# Altium project Servo_arm_controller.PrjPcb
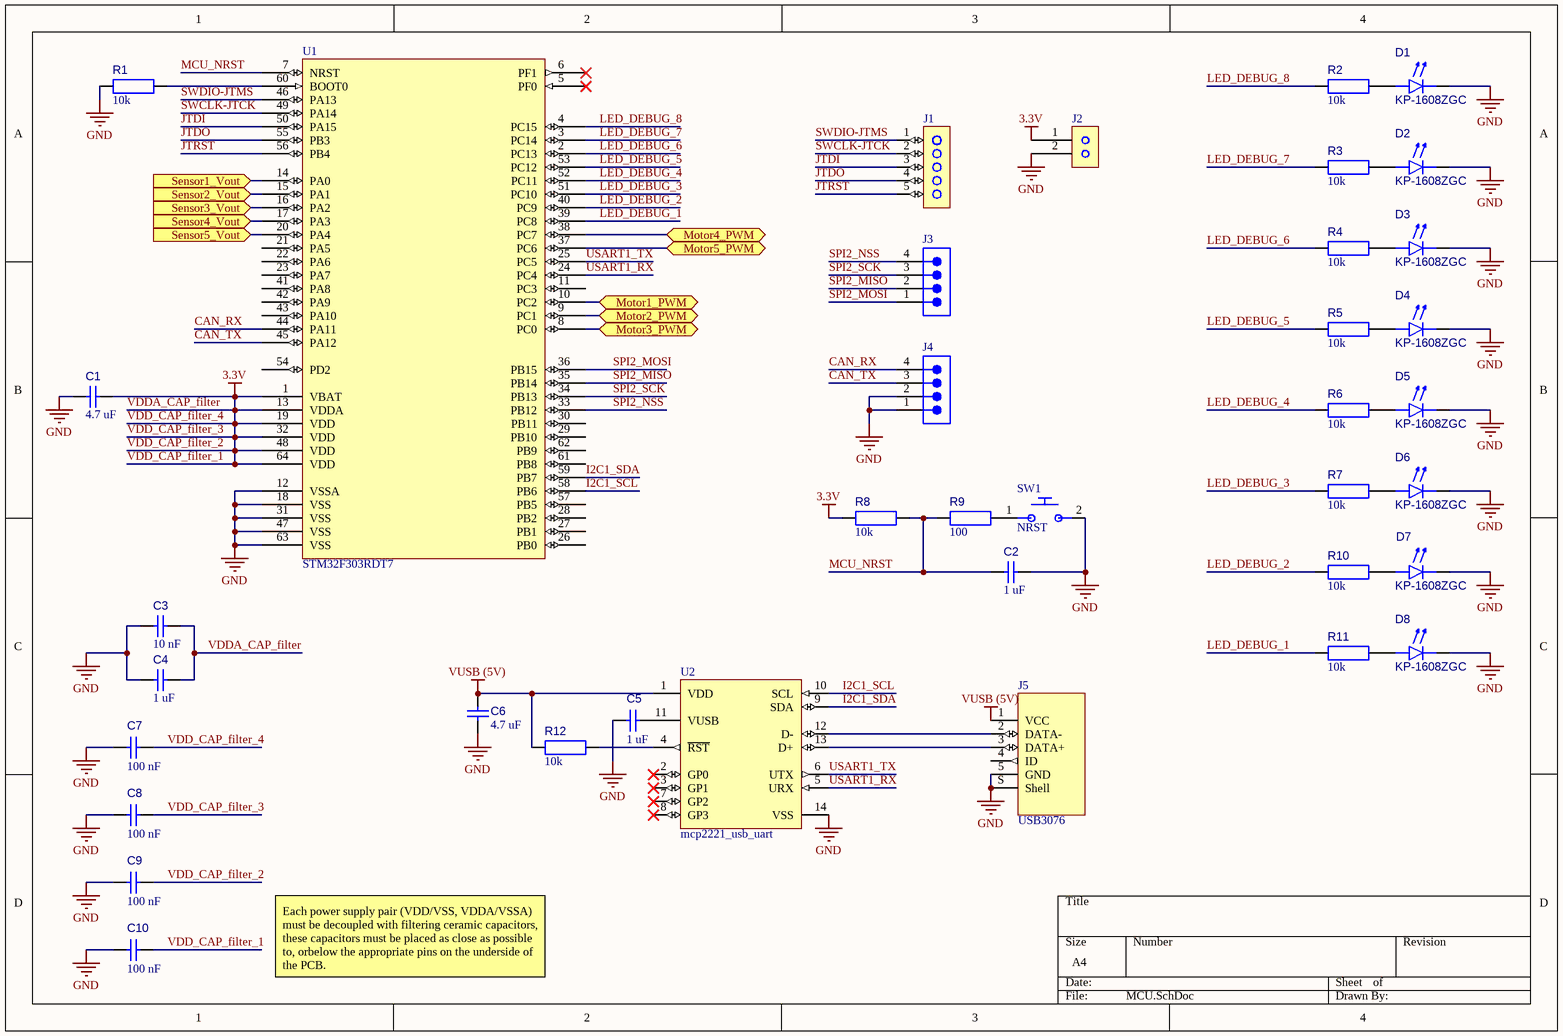
[diagram p0: MCU.SchDoc]
2 sheets, 70 parts. Net scope: flat (ports and power ports of the same name join across sheets).
Board file: Arm_controller.PcbDoc
Sheets:
  MCU.SchDoc
  Signal_and_supply.SchDoc

## Sheet MCU.SchDoc
size A4; SheetNumber: 1; SheetTotal: 2

### Parts
C1  Capacitance: 4.7 uF  [CAPC1608X08N]  (hidden comment: Capacitor 0603 generic)
C2  Capacitance: 1 uF  [CAPC1608X08N]  (hidden comment: Capacitor 0603 generic)
C3  Capacitance: 10 nF  [CAPC1608X08N]  (hidden comment: Capacitor 0603 generic)
C4  Capacitance: 1 uF  [CAPC1608X08N]  (hidden comment: Capacitor 0603 generic)
C5  Capacitance: 1 uF  [CAPC1608X08N]  (hidden comment: Capacitor 0603 generic)
C6  Capacitance: 4.7 uF  [CAPC1608X08N]  (hidden comment: Capacitor 0603 generic)
C7  Capacitance: 100 nF  [CAPC1608X08N]  (hidden comment: Capacitor 0603 generic)
C8  Capacitance: 100 nF  [CAPC1608X08N]  (hidden comment: Capacitor 0603 generic)
C9  Capacitance: 100 nF  [CAPC1608X08N]  (hidden comment: Capacitor 0603 generic)
C10  Capacitance: 100 nF  [CAPC1608X08N]  (hidden comment: Capacitor 0603 generic)
D1  KP-1608ZGC  [DIOM1608X11N]
D2  KP-1608ZGC  [DIOM1608X11N]
D3  KP-1608ZGC  [DIOM1608X11N]
D4  KP-1608ZGC  [DIOM1608X11N]
D5  KP-1608ZGC  [DIOM1608X11N]
D6  KP-1608ZGC  [DIOM1608X11N]
D7  KP-1608ZGC  [DIOM1608X11N]
D8  KP-1608ZGC  [DIOM1608X11N]
J1  Header-2.54-ZL201-05G  [Header-2.54-ZL201-05G-Footprint-1]  (value not drawn)
J2  2_pin_f_2_54  [2_pin_f_2_54-Footprint-1]  (value not drawn)
J3  MTLW-104-07-F-S-125  [SMTC-MTLW-104-07-X-S-125]  (value not drawn)
J4  MTLW-104-07-F-S-125  [SMTC-MTLW-104-07-X-S-125]  (value not drawn)
J5  USB3076  [USB3076-XX-X_revC]
R1  Resistance: 10k  [RESC1608X04N]  (hidden comment: Resistor 0603 generic)
R2  Resistance: 10k  [RESC1608X04N]  (hidden comment: Resistor 0603 generic)
R3  Resistance: 10k  [RESC1608X04N]  (hidden comment: Resistor 0603 generic)
R4  Resistance: 10k  [RESC1608X04N]  (hidden comment: Resistor 0603 generic)
R5  Resistance: 10k  [RESC1608X04N]  (hidden comment: Resistor 0603 generic)
R6  Resistance: 10k  [RESC1608X04N]  (hidden comment: Resistor 0603 generic)
R7  Resistance: 10k  [RESC1608X04N]  (hidden comment: Resistor 0603 generic)
R8  Resistance: 10k  [RESC1608X04N]  (hidden comment: Resistor 0603 generic)
R9  Resistance: 100  [RESC1608X04N]  (hidden comment: Resistor 0603 generic)
R10  Resistance: 10k  [RESC1608X04N]  (hidden comment: Resistor 0603 generic)
R11  Resistance: 10k  [RESC1608X04N]  (hidden comment: Resistor 0603 generic)
R12  Resistance: 10k  [RESC1608X04N]  (hidden comment: Resistor 0603 generic)
SW1  NRST  [Button 6mm tht-Footprint-1]
U1  STM32F303RDT7  [LQFP50P1235X1235X165-64N]
U2  mcp2221_usb_uart  [FP-C04-065-SL-IPC_B]

### Ports
Motor1_PWM (bidir, see Signal_and_supply[2A]), Motor2_PWM (bidir, see Signal_and_supply[2A]), Motor3_PWM (bidir, see Signal_and_supply[2A]), Motor4_PWM (bidir, see Signal_and_supply[2A]), Motor5_PWM (bidir, see Signal_and_supply[2A]), Sensor1_Vout (in, see Signal_and_supply[4A]), Sensor2_Vout (in, see Signal_and_supply[4B]), Sensor3_Vout (in, see Signal_and_supply[4B]), Sensor4_Vout (in, see Signal_and_supply[4C]), Sensor5_Vout (in, see Signal_and_supply[4C])

### Nets
GND: C1.2 C2.1 C3.2 C4.2 C5.2 C6.2 C7.2 C8.2 C9.2 C10.2 D1.1(-) D2.1(-) D3.1(-) D4.1(-) D5.1(-) D6.1(-) D7.1(-) D8.1(-) J2.2(GND) J4.1 J4.2 J5.5(GND) J5.S(Shell) R1.1 SW1.2 U1.12(VSSA) U1.18(VSS) U1.31(VSS) U1.47(VSS) U1.63(VSS) U2.14(VSS)
VDD_CAP_filter_1: C1.1 C3.1 C4.1 C7.1 C8.1 C9.1 C10.1 J2.1(VDD) R8.1 U1.1(VBAT) U1.13(VDDA) U1.19(VDD) U1.32(VDD) U1.48(VDD) U1.64(VDD)  [also labelled 3.3V, VDD_CAP_filter_2, VDD_CAP_filter_3, VDD_CAP_filter_4, VDDA_CAP_filter]
VUSB (5V): C6.1 J5.1(VCC) R12.2 U2.1(VDD)
CAN_RX: J4.4 U1.44(PA11)
CAN_TX: J4.3 U1.45(PA12)
I2C1_SCL: U1.58(PB6) U2.10(SCL)
I2C1_SDA: U1.59(PB7) U2.9(SDA)
JTDI: J1.3 U1.50(PA15)
JTDO: J1.4 U1.55(PB3)
JTRST: J1.5 U1.56(PB4)
LED_DEBUG_1: R11.1 U1.39(PC8)
LED_DEBUG_2: R10.1 U1.40(PC9)
LED_DEBUG_3: R7.1 U1.51(PC10)
LED_DEBUG_4: R6.1 U1.52(PC11)
LED_DEBUG_5: R5.1 U1.53(PC12)
LED_DEBUG_6: R4.1 U1.2(PC13)
LED_DEBUG_7: R3.1 U1.3(PC14)
LED_DEBUG_8: R2.1 U1.4(PC15)
MCU_NRST: C2.2 R8.2 R9.1 U1.7(NRST)
Motor1_PWM: U1.10(PC2) ; port Motor1_PWM
Motor2_PWM: U1.9(PC1) ; port Motor2_PWM
Motor3_PWM: U1.8(PC0) ; port Motor3_PWM
Motor4_PWM: U1.38(PC7) ; port Motor4_PWM
Motor5_PWM: U1.37(PC6) ; port Motor5_PWM
SPI2_MISO: J3.2 U1.35(PB14)
SPI2_MOSI: J3.1 U1.36(PB15)
SPI2_NSS: J3.4 U1.33(PB12)
SPI2_SCK: J3.3 U1.34(PB13)
SWCLK-JTCK: J1.2 U1.49(PA14)
SWDIO-JTMS: J1.1 U1.46(PA13)
USART1_RX: U1.24(PC4) U2.5(URX)
USART1_TX: U1.25(PC5) U2.6(UTX)
NetC5_1: C5.1 U2.11(VUSB)
NetD1_2: D1.2(+) R2.2
NetD2_2: D2.2(+) R3.2
NetD3_2: D3.2(+) R4.2
NetD4_2: D4.2(+) R5.2
NetD5_2: D5.2(+) R6.2
NetD6_2: D6.2(+) R7.2
NetD7_2: D7.2(+) R10.2
NetD8_2: D8.2(+) R11.2
NetJ5_2: J5.2(DATA-) U2.12(D-)
NetJ5_3: J5.3(DATA+) U2.13(D+)
NetR1_2: R1.2 U1.60(BOOT0)
NetR9_2: R9.2 SW1.1
NetR12_1: R12.1 U2.4(~{RST})
NetU1_14: U1.14(PA0) ; port Sensor1_Vout
NetU1_15: U1.15(PA1) ; port Sensor2_Vout
NetU1_16: U1.16(PA2) ; port Sensor3_Vout
NetU1_17: U1.17(PA3) ; port Sensor4_Vout
NetU1_20: U1.20(PA4) ; port Sensor5_Vout

Not connected (* = marked no-connect by the designer): J5 4(ID); U1 5(PF0)* 6(PF1)* 11(PC3) 21(PA5) 22(PA6) 23(PA7) 26(PB0) 27(PB1) 28(PB2) 29(PB10) 30(PB11) 41(PA8) 42(PA9) 43(PA10) 54(PD2) 57(PB5) 61(PB8) 62(PB9); U2 2(GP0)* 3(GP1)* 7(GP2)* 8(GP3)*

### Notes on the sheet
- Each power supply pair (VDD/VSS, VDDA/VSSA) must be decoupled with filtering ceramic capacitors, these capacitors must be placed as close as possible to, orbelow the appropriate pins on the underside of the PCB.

### Library data of the parts
C1-C10 = CMP-001-00083-2: Generic 0603 capacitor. No set voltage/capacitance rating.
D1-D8 = CMP-007-00036-1: Single Color LED, Green, Water Clear, 1.2mm; Forward Current: 25mA; Max Operating Temperature: 85°C; RoHS Compliant: Yes; Min Operating Temperature: -40°C; Pins: 2; Mounting Technology: Surface Mount
J1 = CMP-00028-00007-3: Male header, pitch 2.54 mm, 1x5 pins
J2 = CMP-00028-00011-1: 2 pin female header, 2.54 mm pitch.
J3 J4 = CMP-1024-00073-1: Low Profile .025" SQ Post Header, Through-hole, Vertical, -55 to 125 degC, 2.54 mm Pitch, 4-Pin, Male, RoHS; Manufacturer: Samtec; Pitch: 2.54 mm; ComponentLink1URL: http://www.samtec.com; PartNumber: MTLW-104-07-F-S-125; Mounting Technology: Through-hole; ComponentLink2Description: Datasheet; Orientation: Vertical; PackageReference: MTLW-104-07-X-S-125; ComponentLink2URL: http://www.samtec.com/documents/webfiles/pdf/MTLW_TH.PDF; ComponentLink3URL: http://www.samtec.com/documents/webfiles/cpdf/MTLW-1XX-XX-XX-X-XXX-XX-XX-MKT1.pdf; ComponentLink1Description: Manufacturer URL; PackageVersion: T, 6/1991; Temperature Range: -55 to 125 degC; RoHS: True; DatasheetVersion: F-214; PackageDescription: Low Profile Terminal Assembly; ComponentLink3Description: Package Specification
J5 = CMP-003-000000-4: Micro USB Receptacle, Type B, SMT, Horizontal, Bottom Mount, without Peg, with Outer Shell Stakes, without Mating Face Lead-In; Pin Count: 6; Source: USB3076-XX-X_revC.SchLib; Design Item ID: USB3076-XX-X_revC; Component Type: Standard
R1-R12 = CMP-009-00177-2: Generic 0603 resistor, no fixed value.
SW1 = CMP-00028-00009-2: Button 6mm tht; Pins: 2
U1 = CMP-020-00023-3: ARM Microcontroller, 32-Bit, FLASH, CORTEX-M4F CPU, 72MHz, CMOS, LQFP64; Interface: I2C,SPI,USB,CAN,I2S,IrDA,UART,USART,LIN; Case/Package: LQFP; Pins: 64; Min Operating Temperature: -40°C; Max Operating Temperature: 105°C; RoHS Compliant: Yes
U2 = CMP-015-00009-2: Usb uart converter.; Max Supply Voltage: 5.5V; Min Supply Voltage: 3V; Nominal Supply Voltage: 3.3V; Min Operating Temperature: -40°C; Pins: 14; Max Operating Temperature: 85°C; RoHS Compliant: Yes; Case/Package: SOP

## Sheet Signal_and_supply.SchDoc
size A4; SheetNumber: 2; SheetTotal: 2
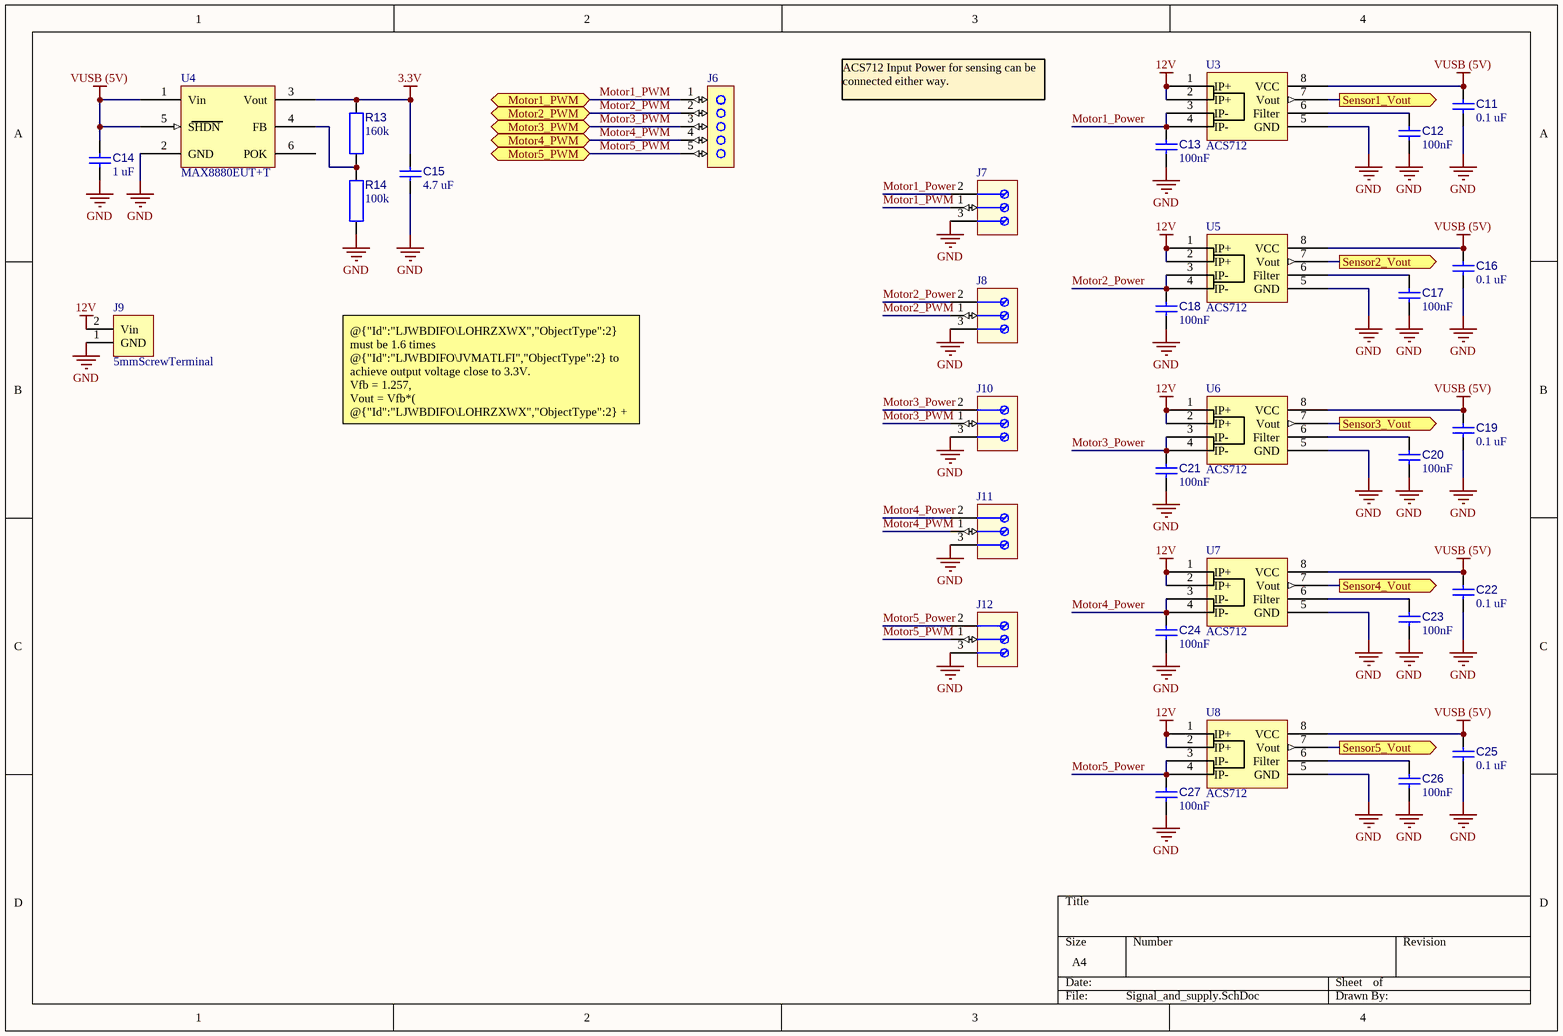
[diagram p1: Signal_and_supply.SchDoc]

### Parts
C11  Capacitance: 0.1 uF  [CAPC1608X08N]  (hidden comment: Capacitor 0603 generic)
C12  value 100nF  [CAPC1608X90X40NL10T20]  (hidden comment: Capacitor 100 nF +/-10% 50 V 0603)
C13  value 100nF  [CAPC1608X90X40NL10T20]  (hidden comment: Capacitor 100 nF +/-10% 50 V 0603)
C14  Capacitance: 1 uF  [CAPC1608X08N]  (hidden comment: Capacitor 0603 generic)
C15  Capacitance: 4.7 uF  [CAPC1608X08N]  (hidden comment: Capacitor 0603 generic)
C16  Capacitance: 0.1 uF  [CAPC1608X08N]  (hidden comment: Capacitor 0603 generic)
C17  value 100nF  [CAPC1608X90X40NL10T20]  (hidden comment: Capacitor 100 nF +/-10% 50 V 0603)
C18  value 100nF  [CAPC1608X90X40NL10T20]  (hidden comment: Capacitor 100 nF +/-10% 50 V 0603)
C19  Capacitance: 0.1 uF  [CAPC1608X08N]  (hidden comment: Capacitor 0603 generic)
C20  value 100nF  [CAPC1608X90X40NL10T20]  (hidden comment: Capacitor 100 nF +/-10% 50 V 0603)
C21  value 100nF  [CAPC1608X90X40NL10T20]  (hidden comment: Capacitor 100 nF +/-10% 50 V 0603)
C22  Capacitance: 0.1 uF  [CAPC1608X08N]  (hidden comment: Capacitor 0603 generic)
C23  value 100nF  [CAPC1608X90X40NL10T20]  (hidden comment: Capacitor 100 nF +/-10% 50 V 0603)
C24  value 100nF  [CAPC1608X90X40NL10T20]  (hidden comment: Capacitor 100 nF +/-10% 50 V 0603)
C25  Capacitance: 0.1 uF  [CAPC1608X08N]  (hidden comment: Capacitor 0603 generic)
C26  value 100nF  [CAPC1608X90X40NL10T20]  (hidden comment: Capacitor 100 nF +/-10% 50 V 0603)
C27  value 100nF  [CAPC1608X90X40NL10T20]  (hidden comment: Capacitor 100 nF +/-10% 50 V 0603)
J6  Header-2.54-ZL201-05G  [Header-2.54-ZL201-05G-Footprint-1]  (value not drawn)
J7  691103110003  [691103110003]  (value not drawn)
J8  691103110003  [691103110003]  (value not drawn)
J9  5mmScrewTerminal  [5mmScrewTerminal-Footprint-1]
J10  691103110003  [691103110003]  (value not drawn)
J11  691103110003  [691103110003]  (value not drawn)
J12  691103110003  [691103110003]  (value not drawn)
R13  Resistance: 160k  [RESC1608X04N]  (hidden comment: Resistor 0603 generic)
R14  Resistance: 100k  [RESC1608X04N]  (hidden comment: Resistor 0603 generic)
U3  ACS712  [SOIC127P600X175-8N]
U4  MAX8880EUT+T  [SOT95P280X145-6N]
U5  ACS712  [SOIC127P600X175-8N]
U6  ACS712  [SOIC127P600X175-8N]
U7  ACS712  [SOIC127P600X175-8N]
U8  ACS712  [SOIC127P600X175-8N]

### Ports
Motor1_PWM (bidir, see MCU[2B]), Motor2_PWM (bidir, see MCU[2B]), Motor3_PWM (bidir, see MCU[2B]), Motor4_PWM (bidir, see MCU[2A]), Motor5_PWM (bidir, see MCU[2A]), Sensor1_Vout (out, see MCU[1A]), Sensor2_Vout (out, see MCU[1A]), Sensor3_Vout (out, see MCU[1A]), Sensor4_Vout (out, see MCU[1A]), Sensor5_Vout (out, see MCU[1A])

### Nets
3.3V: C15.1 R13.1 U4.3(Vout)  [project net VDD_CAP_filter_1]
12V: J9.2(Vin) U3.1(IP+) U3.2(IP+) U5.1(IP+) U5.2(IP+) U6.1(IP+) U6.2(IP+) U7.1(IP+) U7.2(IP+) U8.1(IP+) U8.2(IP+)
GND: C11.2 C12.1 C13.1 C14.1 C15.2 C16.2 C17.1 C18.1 C19.2 C20.1 C21.1 C22.2 C23.1 C24.1 C25.2 C26.1 C27.1 J7.3(GND) J8.3(GND) J9.1(GND) J10.3(GND) J11.3(GND) J12.3(GND) R14.2 U3.5(GND) U4.2(GND) U5.5(GND) U6.5(GND) U7.5(GND) U8.5(GND)
VUSB (5V): C11.1 C14.2 C16.1 C19.1 C22.1 C25.1 U3.8(VCC) U4.1(Vin) U4.5(SHDN) U5.8(VCC) U6.8(VCC) U7.8(VCC) U8.8(VCC)
Motor1_Power: C13.2 J7.2(V+) U3.3(IP-) U3.4(IP-)
Motor1_PWM: J6.1 J7.1(PWM) ; port Motor1_PWM
Motor2_Power: C18.2 J8.2(V+) U5.3(IP-) U5.4(IP-)
Motor2_PWM: J6.2 J8.1(PWM) ; port Motor2_PWM
Motor3_Power: C21.2 J10.2(V+) U6.3(IP-) U6.4(IP-)
Motor3_PWM: J6.3 J10.1(PWM) ; port Motor3_PWM
Motor4_Power: C24.2 J11.2(V+) U7.3(IP-) U7.4(IP-)
Motor4_PWM: J6.4 J11.1(PWM) ; port Motor4_PWM
Motor5_Power: C27.2 J12.2(V+) U8.3(IP-) U8.4(IP-)
Motor5_PWM: J6.5 J12.1(PWM) ; port Motor5_PWM
NetC12_2: C12.2 U3.6(Filter)
NetC17_2: C17.2 U5.6(Filter)
NetC20_2: C20.2 U6.6(Filter)
NetC23_2: C23.2 U7.6(Filter)
NetC26_2: C26.2 U8.6(Filter)
NetR13_2: R13.2 R14.1 U4.4(FB)
NetU1_14: U3.7(Vout) ; port Sensor1_Vout
NetU1_15: U5.7(Vout) ; port Sensor2_Vout
NetU1_16: U6.7(Vout) ; port Sensor3_Vout
NetU1_17: U7.7(Vout) ; port Sensor4_Vout
NetU1_20: U8.7(Vout) ; port Sensor5_Vout

Not connected (* = marked no-connect by the designer): U4 6(POK)

### Notes on the sheet
- ACS712 Input Power for sensing can be connected either way.
- @{"Id":"LJWBDIFO\LOHRZXWX","ObjectType":2} must be 1.6 times @{"Id":"LJWBDIFO\JVMATLFI","ObjectType":2} to achieve output voltage close to 3.3V.
  Vfb = 1.257,
  Vout = Vfb*( @{"Id":"LJWBDIFO\LOHRZXWX","ObjectType":2} + @{"Id":"LJWBDIFO\JVMATLFI","ObjectType":2} )/ @{"Id":"LJWBDIFO\JVMATLFI","ObjectType":2} = 3.268 V.
  Settin @{"Id":"LJWBDIFO\JVMATLFI","ObjectType":2} to 1 megaohm  and calculating @{"Id":"LJWBDIFO\LOHRZXWX","ObjectType":2} would result in marginally less current consumption.

### Library data of the parts
C11 C14-C16 C19 C22 C25 = CMP-001-00083-2: as C1 on sheet MCU
C12 C13 C17 C18 C20 C21 C23 C24 C26 C27 = CMP-001-00017-6: Chip Capacitor, 100 nF, +/- 10%, 50 V, 0603 (1608 Metric); Voltage Rating: 50V; Capacitor Type: Ceramic; Tolerance: 10%; Mounting Technology: SM; Max Operating Temperature: 125°C; RoHS Compliant: True; Pins: 2; Case/Package: 0603; Min Operating Temperature: -55°C
J6 = CMP-00028-00007-3: Male header, pitch 2.54 mm, 1x5 pins
J7 J8 J10-J12 = CMP-00028-00008-2: Barrier Strip Terminal Block; RoHS Compliant: Yes
J9 = CMP-00028-00010-3: 16A 5 mm pitch screw terminal, 2 sockets.
R13 R14 = CMP-009-00177-2: Generic 0603 resistor, no fixed value.
U3 U5-U8 = CMP-010-00024-2: Integrated, Hall-Effect-Based Linear Current Sensor IC; Nominal Supply Current: 10mA; Max Supply Voltage: 8V; Output Current: 3mA; Min Supply Voltage: 4.5V; Nominal Supply Voltage: 5V; Sensor Type: analog current sensor; ComponentLink1URL: https://www.farnell.com/datasheets/3283075.pdf?_gl=1*655fm5*_gcl_aw*R0NMLjE3MjkyNjA3NzYuQ2p3S0NBandqc2k0QmhCNUVpd0FGQUwwWUJJQ1IwTktsZUpReWIxcFRubGxNLVh3bUhQcFctSFhLUnYtVFFUc01qMmhGYkt5YWJZdmpob0N3c0lRQXZEX0J3RQ..*_gcl_au*MTA1Mjg3ODU0LjE3Mjc3MDI1ODg.; Max Operating Temperature: 85°C; Mounting Technology: smd; Min Operating Temperature: -40°C; RoHS Compliant: yes; Pins: 8; ComponentLink1Description: Datasheet; Case/Package: SOIC8
U4 = CMP-019-00049-1: Ultra-Low-IQ, Low-Dropout Linear Regulator, output 1.25 - 5.5 V.; Max Supply Voltage: 12V; Nominal Supply Current: 3mA; Output Current: 200mA; Output Voltage: 3.3V; Min Supply Voltage: 2.5V; Dropout Voltage: 100mV; Pins: 6; Case/Package: SOT-6; Mounting Technology: smd; Min Operating Temperature: -40°C; RoHS Compliant: yes; Max Operating Temperature: 125°C

## Nets that join several sheets
GND: MCU (31 pins), Signal_and_supply (30 pins)
VDD_CAP_filter_1: MCU (15 pins), Signal_and_supply (C15.1 R13.1 U4.3)
VUSB (5V): MCU (C6.1 J5.1 R12.2 U2.1), Signal_and_supply (13 pins)
Motor1_PWM: MCU (U1.10), Signal_and_supply (J6.1 J7.1)
Motor2_PWM: MCU (U1.9), Signal_and_supply (J6.2 J8.1)
Motor3_PWM: MCU (U1.8), Signal_and_supply (J6.3 J10.1)
Motor4_PWM: MCU (U1.38), Signal_and_supply (J6.4 J11.1)
Motor5_PWM: MCU (U1.37), Signal_and_supply (J6.5 J12.1)
NetU1_14: MCU (U1.14), Signal_and_supply (U3.7)
NetU1_15: MCU (U1.15), Signal_and_supply (U5.7)
NetU1_16: MCU (U1.16), Signal_and_supply (U6.7)
NetU1_17: MCU (U1.17), Signal_and_supply (U7.7)
NetU1_20: MCU (U1.20), Signal_and_supply (U8.7)